# Altium project Zynq 7000 Demo.PrjPcb (part 8 of 9)

## Sheet [12] - CAN & RS232.SchDoc: CAN & RS232
size B; Organization: Altium Limited; Address1: L3, 12a Rodborough Rd; Address2: Frenchs Forest; Address3: NSW; Address4: Australia 2086; DocumentNumber: 12; Revision: V1I1; SheetNumber: 12; SheetTotal: 16
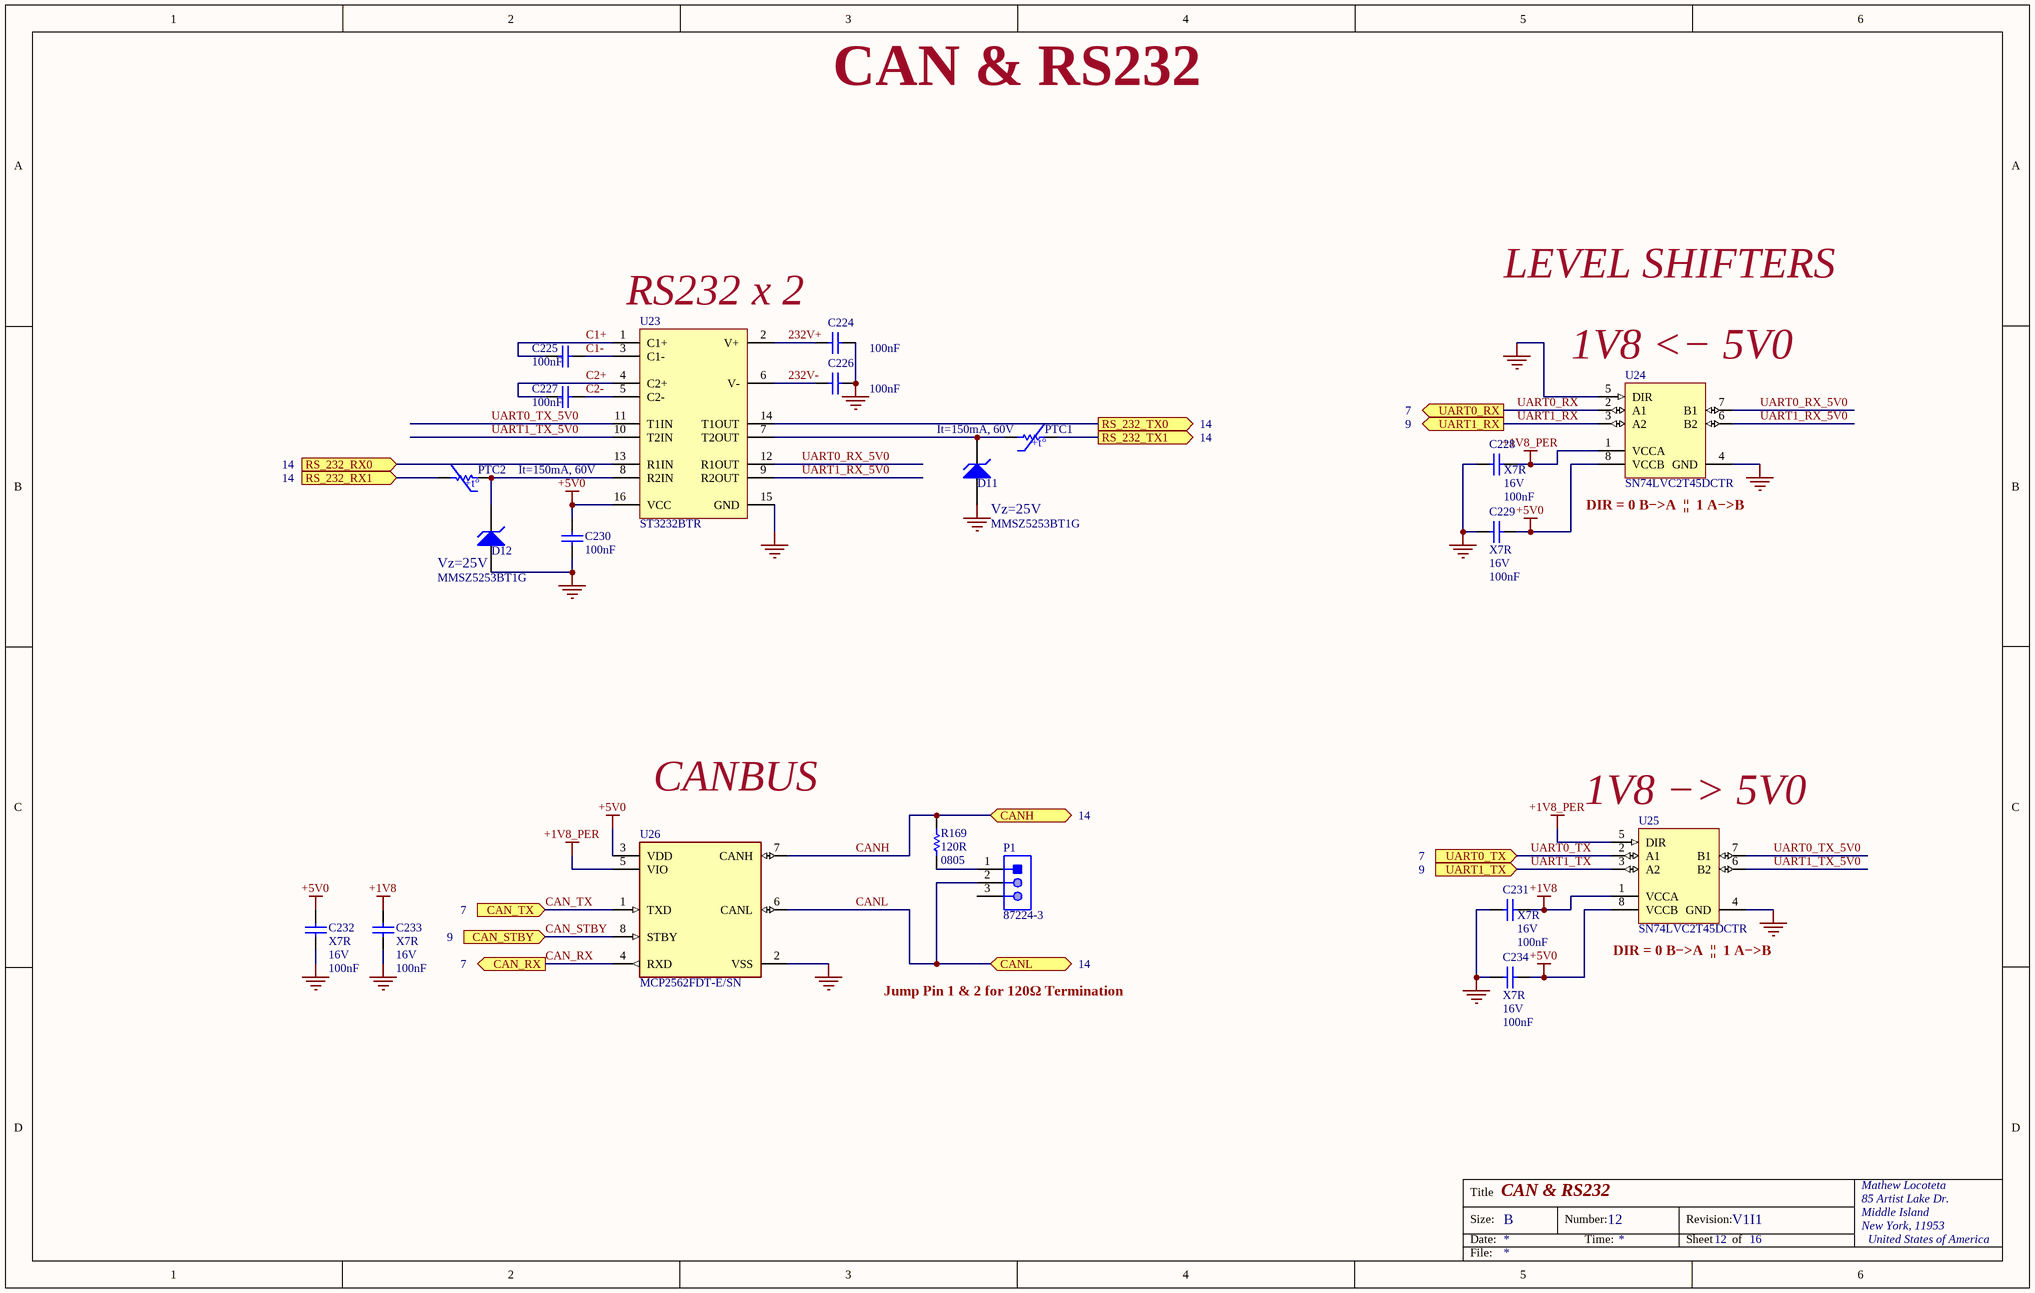
[diagram p11: [12] - CAN & RS232.SchDoc]

### Parts
C224  Capacitance: 100nF  (hidden comment: 100nF 0402 16V)
C225  Capacitance: 100nF  (hidden comment: 100nF 0402 16V)
C226  Capacitance: 100nF  (hidden comment: 100nF 0402 16V)
C227  Capacitance: 100nF  (hidden comment: 100nF 0402 16V)
C228  Dielectric: X7R  Voltage Rating: 16V  Capacitance: 100nF  (hidden comment: 100nF 0402 16V)
C229  Dielectric: X7R  Voltage Rating: 16V  Capacitance: 100nF  (hidden comment: 100nF 0402 16V)
C230  Capacitance: 100nF  (hidden comment: 100nF 0402 16V)
C231  Dielectric: X7R  Voltage Rating: 16V  Capacitance: 100nF  (hidden comment: 100nF 0402 16V)
C232  Dielectric: X7R  Voltage Rating: 16V  Capacitance: 100nF  (hidden comment: 100nF 0402 16V)
C233  Dielectric: X7R  Voltage Rating: 16V  Capacitance: 100nF  (hidden comment: 100nF 0402 16V)
C234  Dielectric: X7R  Voltage Rating: 16V  Capacitance: 100nF  (hidden comment: 100nF 0402 16V)
D11  MMSZ5253BT1G  [ONSC-SOD-123-2-425-04_V]
D12  MMSZ5253BT1G  [ONSC-SOD-123-2-425-04_V]
P1  87224-3  [TECO-87224-3_V]
PTC1  It=150mA, 60V  [R1206]
PTC2  It=150mA, 60V  [R1206]
R169  value 120R  Case: 0805  [RESC2013X50X30LL20T20]  (hidden comment: CRCW0805120RJNEA)
U23  ST3232BTR  [STM-TSSOP-16_L]
U24  SN74LVC2T45DCTR  [DCT0008A_N]
U25  SN74LVC2T45DCTR  [DCT0008A_N]
U26  MCP2562FDT-E/SN  [FP-C04-057-SN-MFG]

### Ports
CAN_RX (out), CAN_STBY (in), CAN_TX (in), CANH (bidir), CANL (bidir), RS_232_RX0 (in), RS_232_RX1 (in), RS_232_TX0 (out), RS_232_TX1 (out), UART0_RX (out), UART0_TX (in), UART1_RX (out), UART1_TX (in)

### Nets
+1V8: C231.1 C233.2 U25.1(VCCA)
+1V8_PER: C228.1 U24.1(VCCA) U25.5(DIR) U26.5(VIO)
+5V0: C229.2 C230.2 C232.2 C234.2 U23.16(VCC) U24.8(VCCB) U25.8(VCCB) U26.3(VDD)
GND: C224.1 C226.1 C228.2 C229.1 C230.1 C231.2 C232.1 C233.1 C234.1 D11.2(A) D12.2(A) U23.15(GND) U24.4(GND) U24.5(DIR) U25.4(GND) U26.2(VSS)
232V+: C224.2 U23.2(V+)
232V-: C226.2 U23.6(V-)
C1+: C225.1 U23.1(C1+)
C1-: C225.2 U23.3(C1-)
C2+: C227.1 U23.4(C2+)
C2-: C227.2 U23.5(C2-)
CAN_RX: U26.4(RXD) ; port CAN_RX
CAN_STBY: U26.8(STBY) ; port CAN_STBY
CAN_TX: U26.1(TXD) ; port CAN_TX
CANH: R169.1 U26.7(CANH) ; port CANH
CANL: P1.2 U26.6(CANL) ; port CANL
RS_232_RX0: U23.13(R1IN) ; port RS_232_RX0
RS_232_RX1: PTC2.2 ; port RS_232_RX1
RS_232_TX0: U23.14(T1OUT) ; port RS_232_TX0
RS_232_TX1: PTC1.2 ; port RS_232_TX1
UART0_RX: U24.2(A1) ; port UART0_RX
UART0_RX_5V0: U23.12(R1OUT) U24.7(B1)
UART0_TX: U25.2(A1) ; port UART0_TX
UART0_TX_5V0: U23.11(T1IN) U25.7(B1)
UART1_RX: U24.3(A2) ; port UART1_RX
UART1_RX_5V0: U23.9(R2OUT) U24.6(B2)
UART1_TX: U25.3(A2) ; port UART1_TX
UART1_TX_5V0: U23.10(T2IN) U25.6(B2)
NetD11_1: D11.1(K) PTC1.1 U23.7(T2OUT)
NetD12_1: D12.1(K) PTC2.1 U23.8(R2IN)
NetP1_1: P1.1 R169.2

Not connected (* = marked no-connect by the designer): P1 3

### Notes on the sheet
- CAN & RS232
- LEVEL SHIFTERS
- RS232 x 2
- (near U24) 1V8 <− 5V0
- 14
- 7
- 9
- (near U24) DIR = 0 B−>A  ||  1 A−>B
- (near D12) Vz=25V
- (near D11) Vz=25V
- CANBUS
- (near U25) 1V8 −> 5V0
- (near U25) DIR = 0 B−>A  ||  1 A−>B
- Jump Pin 1 & 2 for 120Ω Termination
- Title
- Size:
- Date:
- B
- Number:
- Time:
- Revision:
- Sheet
- of
- Mathew Locoteta
- 85 Artist Lake Dr.
- Middle Island
- New York, 11953
- United States of America
- File:
- (in symbol 0ZCJ0005FF2E) +t°

### Library data of the parts
C224-C234 = C0402C104J4RACTU: as C159-C171 on sheet [9] - Z7010 B35, ADC, DAC; Supplier 1: Digi-Key; Manufacturer: KEMET; Manufacturer Part Number: C0402C104J4RACTU; RoHS: Yes; Category: Ceramic Capacitors; Stock 1: 106350; Pricing 1: 1=0.48000, 10=0.33900, 50=0.25620, 100=0.22310, 500=0.16528, 1000=0.14049, 2500=0.13223, 5000=0.12396 (USD); Mount: Surface Mount,PCB; Case/Package: 0402; Case Code (Metric): 1005; Case Code (Imperial): 0402; Dielectric Material: Ceramic; Contact Plating: Tin,Matte; Min Operating Temperature: -55°C; Max Operating Temperature: 125°C; Tolerance: 5%; Packaging: Tape and Reel; Package Quantity: 1; Termination: SMD/SMT; Voltage: 16V; Length: 1mm; Height: 0.5mm; Width: 0.02inch; Thickness: 0.022inch; Depth: 0.5mm; Radiation Hardening: No; REACH SVHC: No SVHC; ComponentLink1URL: https://datasheet.ciiva.com/5415/kem-c1002-x7r-smd-5415819.pdf?src-supplier=Mouser; ComponentLink1Description: https://datasheet.ciiva.com/5415/kem-c1002-x7r-smd-5415819.pdf?src-supplier=Mouser; ComponentLink2URL: https://datasheet.ciiva.com/46424/1851736-46424159.pdf?src-supplier=Element14; ComponentLink2Description: https://datasheet.ciiva.com/46424/1851736-46424159.pdf?src-supplier=Element14; Supplier Part Number 1: 399-7761-1-ND; Voltage Rating (DC): 16V
  C224-C227 C230: Dielectric: X7R; Voltage Rating: 16V
D11 D12 = CMP-1060-00460-1: Zener Voltage Regulator, 500 mW, 2-Pin SOD-123, Pb-Free, Tape and Reel; Manufacturer: On Semiconductor; P Max (W): 0.5; VZ Typ (V): 25; PackageVersion: Rev. G, 10/2009; RoHS: Pb-Free; PartNumber: MMSZ5253BT1G; DatasheetVersion: Rev. 12; PackageReference: SOD-123-2-425-04; ComponentLink2Description: Datasheet; Mounting Technology: Surface Mount; ComponentLink2URL: http://www.onsemi.com/pub_link/Collateral/MMSZ5221BT1-D.PDF; ComponentLink1Description: Manufacturer URL; ComponentLink3Description: Package Specification; ComponentLink3URL: http://www.onsemi.com/pub_link/Collateral/425-04.PDF; Packing: Tape and Reel; ComponentLink1URL: http://www.onsemi.com/; PackageDescription: 2-Pin SOD, Body 1.6 x 2.69 mm
P1 = CMP-2000-05697-1: Male Header, Pitch 2.54 mm, 1 x 3 Position, Height 10.744 mm, Tail Length 3.175 mm, -65 to 105 degC, RoHS, Bulk; Manufacturer: TE Connectivity; Catalog Drawings: SingleSquareStraightPost / SingleSquareStraightPostSide; Connector Type: Header,Unshrouded; Pitch: 0.100"(2.54mm); Mating Products: 147738-2-ND / -CONNRCPT3POSVERTSMDGOLD / 147723-2-ND / -CONNRCPT3POSVERT.100GOLD / 146763-5-ND / -CONNRCPT3POSSGLVERT.100T/H / A32904-ND / -CONNRECEPT3POS.100VERTGOLD / A26922-ND / -CONNHOUSING3POS.100LOCKING / A26415-ND / -CONNRECEPT3POS.100VERTAU / A26964-ND / -CONNHOUSING3POS.100SINGLE / A3012-ND / -CONNHOUSING3POS.100SINGLE; Number of Positions Loaded: All; Featured Product: AMPMODUConnectors; Dynamic Catalog: AMPMODUModIISeries; 3D Model: 87224-3.pdf; Other Names: 87224-3-ND / A26545; Number of Positions: 3; RoHS Information: 87224-3StatementofCompliance; Termination: Solder; Datasheet URL: http://www.te.com/commerce/DocumentDelivery/DDEController?Action=showdoc&DocId=Customer+Drawing%7F87224%7FL3%7Fpdf%7FEnglish%7FENG_CD_87224_L3.pdf%7F87224-3; Category: Connectors,Interconnects; Contact Mating Length: 0.318"(8.08mm); Standard Package: 520; Mounting Type: ThroughHole; Family: RectangularConnectors-Headers,MalePins; Number of Rows: 1; Series: AMPMODUModII; Contact Finish Thickness: 15µin(0.38µm); Datasheet Version: Rev. L3, 08/2015; Package Reference: 87224-3; Mounting Technology: ThroughHole; Manufacturer URL: http://www.te.com/; Contact Type: MalePin; Packaging: Bulk; Color: Black; Package Description: Male Header, Pitch 2.54 mm, 1 x 3 Position, Height 10.744 mm, Tail Length 3.175 mm; Contact Finish: Gold
PTC1 PTC2 = 0ZCJ0005FF2E: PTC RESET FUSE 60V 50MA 1206; Manufacturer: Bel; Max Current Rating: 10A; Power Dissipation: 400mW; Trip Current: 150mA; Time to Trip: 1.5s; Approvals: UL,TUV; Supplier 1: Digi-Key; Manufacturer Part Number: 0ZCJ0005FF2E; RoHS: Yes; Category: Fuses; Stock 1: 295306; Pricing 1: 1=0.13000, 5=0.13000, 10=0.12500, 50=0.11140, 100=0.10370, 250=0.09216, 500=0.07680, 1000=0.07296 (USD); Mount: Surface Mount; Case/Package: 1206; Case Code (Metric): 3216; Case Code (Imperial): 1206; Contact Plating: Tin,Matte; Number of Terminals: 2; Min Operating Temperature: -40°C; Max Operating Temperature: 85°C; Package Quantity: 1; Packaging: Tape and Reel; Max Voltage Rating (DC): 60V; Hold Current: 50mA; Lead Free: Lead Free; ComponentLink1URL: https://datasheet.ciiva.com/18550/0zcj-18550517.pdf?src-supplier=Digi-Key; ComponentLink1Description: https://datasheet.ciiva.com/18550/0zcj-18550517.pdf?src-supplier=Digi-Key; ComponentLink2URL: https://datasheet.ciiva.com/18550/0zcj-18550518.pdf?src-supplier=Digi-Key; ComponentLink2Description: https://datasheet.ciiva.com/18550/0zcj-18550518.pdf?src-supplier=Digi-Key; ComponentLink3URL: https://datasheet.ciiva.com/18550/0zcj-18550519.pdf?src-supplier=Digi-Key; ComponentLink3Description: https://datasheet.ciiva.com/18550/0zcj-18550519.pdf?src-supplier=Digi-Key; Supplier Part Number 1: 507-1793-1-ND
R169 = CMP-2001-04288-1: Manufacturer: Vishay Dale; Part Number: CRCW0805120RJNEA
U23 = CMP-2000-07155-1: RS-232 Driver and Receiver, 3 to 5.5 V, -40 to 85 degC, 16-Pin TSSOP, RoHS, Tape and Reel; Manufacturer: STMicroelectronics; Dual Supply Voltage (Min): NotRequiredV; Power Supply Requirement: Single; Receiver Signal Type: Single-Ended; Number of Transmitters: 2; Single Supply Voltage (Typ): 3.3/5V; Supply Current: 2mA; Single Supply Voltage (Min): 3V; DELETED: Compliant; Data Rate: 0.4kbps; Number of Transceivers: 1; Rad Hardened: No; Single Supply Voltage (Max): 5.5V; Data Transmission Topology: Point-to-Point; Datasheet URL: http://www.st.com/content/ccc/resource/technical/document/datasheet/group1/40/2c/7f/62/3a/3f/47/3c/CD00002253/files/CD00002253.pdf/jcr:content/translations/en.CD00002253.pdf; Dual Supply Voltage (Max): NotRequiredV; Packaging: TapeandReel; Mounting Technology: SurfaceMount; Package Reference: TSSOP-16; Operating Temperature Classification: Industrial; Package Description: 16-Pin Thin Shrink Small Outline Package, Body 5 x 4.4 mm, Pitch 0.65 mm; Operating Temp Range: -40Cto85C; Manufacturer URL: http://www.st.com/; Datasheet Version: Rev. 12, 01/2016; Mounting: SurfaceMount; Dual Supply Voltage (Typ): NotRequiredV; Pin Count: 16; Number of Receivers: 2; Package Type: TSSOP; Interface Circuit Standard 1: RS-232; Transmitter Signal Type: Single-Ended
U24 U25 = CMP-0859-00006-4: Dual-Bit Dual Supply Transceiver with Configurable Voltage Translation and 3-State Outputs, DCT0008A, LARGE T&R; Manufacturer: Texas Instruments; Rating: Military; Input Type: CMOS/TTL; Schmitt Trigger: No; ICC @ Nom Voltage(Max)(mA): 0.004; Bits(#): 2; Logic: True; tpd @ Nom Voltage(Max)(ns): 17.7,10.3,8.3,7.2; VCC(Min)(V): 1.65; Voltage(Nom)(V): 1.8,2.5,3.3,5; Output Type: CMOS; F @ Nom Voltage(Max)(Mhz): 150; Technology Family: LVC; VCC(Max)(V): 5.5; Output Drive (IOL/IOH)(Max)(mA): 32/-32; 3-State Output: Yes; Sub-Family: Dual Supply Translator; Operating Temperature Range(C): -40 to 85; DatasheetVersion: SCES516J; Generic Part Number: SN74LVC2T45; PackageReference: DCT0008A
U26 = CMP-06279-000005-1: IC TRANSCEIVER 1/1 8SOIC; Operating Supply Current: 70mA; Data Rate: 8Mbps; Number of Transceivers: 1; Receiver Hysteresis: 200mV; Max Supply Voltage: 5.5V; Min Supply Voltage: 4.5V; Weight: 0.019048oz; Package Quantity: 3300; Case/Package: SOIC; Mount: Surface Mount; Max Operating Temperature: 125°C; Min Operating Temperature: -40°C; Packaging: Tape and Reel; Number of Pins: 8

## Sheet [13] - HMI.SchDoc: HMI
size B; Organization: Altium Limited; Address1: L3, 12a Rodborough Rd; Address2: Frenchs Forest; Address3: NSW; Address4: Australia 2086; DocumentNumber: 13; Revision: V1I1; SheetNumber: 13; SheetTotal: 16
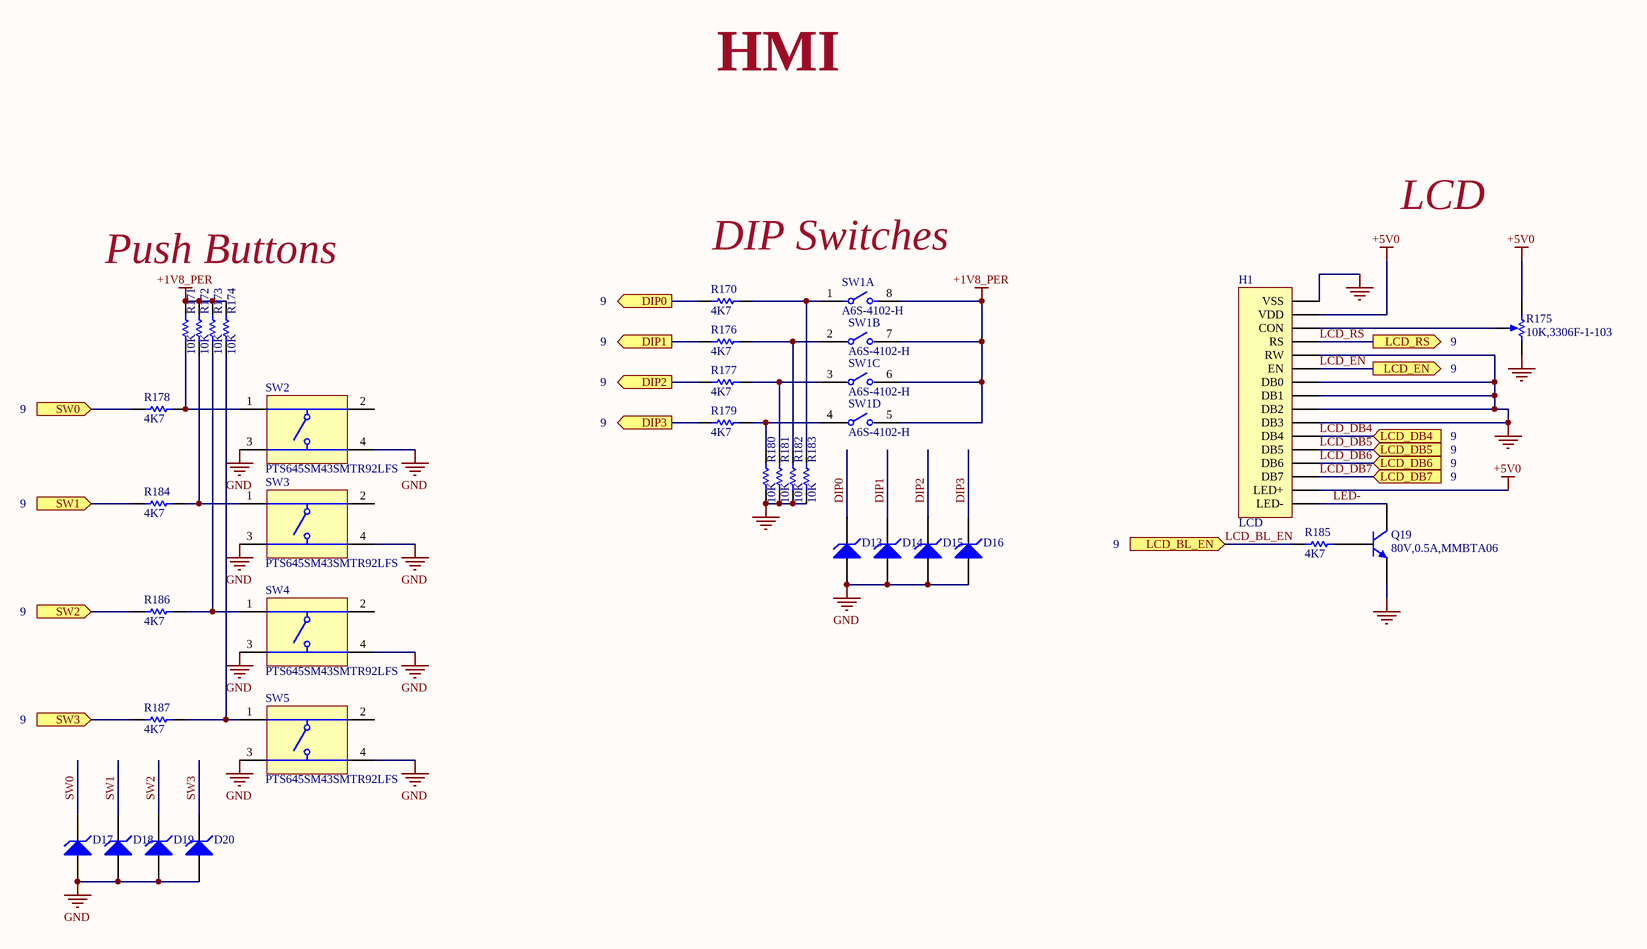
[diagram p12: [13] - HMI.SchDoc]

### Parts
D13  ESD5Z2.5T1G  [ONSC-SOD-523-2-502-01_V]  (value not drawn)
D14  ESD5Z2.5T1G  [ONSC-SOD-523-2-502-01_V]  (value not drawn)
D15  ESD5Z2.5T1G  [ONSC-SOD-523-2-502-01_V]  (value not drawn)
D16  ESD5Z2.5T1G  [ONSC-SOD-523-2-502-01_V]  (value not drawn)
D17  ESD5Z2.5T1G  [ONSC-SOD-523-2-502-01_V]  (value not drawn)
D18  ESD5Z2.5T1G  [ONSC-SOD-523-2-502-01_V]  (value not drawn)
D19  ESD5Z2.5T1G  [ONSC-SOD-523-2-502-01_V]  (value not drawn)
D20  ESD5Z2.5T1G  [ONSC-SOD-523-2-502-01_V]  (value not drawn)
H1  LCD  [16POS 2.54MM, PREC016SFAN-RC]
Q19  80V,0.5A,MMBTA06  [ONSC-SOT-23-3-318-08_V]
R170  Resistance: 4K7  (hidden comment: 4K7 0402 1%)
R171  value 10K  [RESC1005X40X25ML05T10]  (hidden comment: CRCW040210K0FKEDHP)
R172  value 10K  [RESC1005X40X25ML05T10]  (hidden comment: CRCW040210K0FKEDHP)
R173  value 10K  [RESC1005X40X25ML05T10]  (hidden comment: CRCW040210K0FKEDHP)
R174  value 10K  [RESC1005X40X25ML05T10]  (hidden comment: CRCW040210K0FKEDHP)
R175  10K,3306F-1-103  [Pot, 3306F-1-103]
R176  Resistance: 4K7  (hidden comment: 4K7 0402 1%)
R177  Resistance: 4K7  (hidden comment: 4K7 0402 1%)
R178  Resistance: 4K7  (hidden comment: 4K7 0402 1%)
R179  Resistance: 4K7  (hidden comment: 4K7 0402 1%)
R180  value 10K  [RESC1005X40X25ML05T10]  (hidden comment: CRCW040210K0FKEDHP)
R181  value 10K  [RESC1005X40X25ML05T10]  (hidden comment: CRCW040210K0FKEDHP)
R182  value 10K  [RESC1005X40X25ML05T10]  (hidden comment: CRCW040210K0FKEDHP)
R183  value 10K  [RESC1005X40X25ML05T10]  (hidden comment: CRCW040210K0FKEDHP)
R184  Resistance: 4K7  (hidden comment: 4K7 0402 1%)
R185  4K7  [R0805]
R186  Resistance: 4K7  (hidden comment: 4K7 0402 1%)
R187  Resistance: 4K7  (hidden comment: 4K7 0402 1%)
SW1  A6S-4102-H  [FP-A6S-4102-H-MFG]  (parts A,B,C,D of 4)
SW2  PTS645SM43SMTR92LFS  [ITT-PTS645S-4_V]
SW3  PTS645SM43SMTR92LFS  [ITT-PTS645S-4_V]
SW4  PTS645SM43SMTR92LFS  [ITT-PTS645S-4_V]
SW5  PTS645SM43SMTR92LFS  [ITT-PTS645S-4_V]

### Ports
DIP0 (out), DIP1 (out), DIP2 (out), DIP3 (out), LCD_BL_EN (in), LCD_DB4 (in), LCD_DB5 (in), LCD_DB6 (in), LCD_DB7 (in), LCD_EN (out), LCD_RS (out), SW0 (in), SW1 (in), SW2 (in), SW3 (in)

### Nets
+1V8_PER: R171.2 R172.2 R173.2 R174.2 SW1.5 SW1.6 SW1.7 SW1.8
+5V0: H1.2(VDD) H1.15(LED+) R175.1(CCW)
GND: D13.2(A) D14.2(A) D15.2(A) D16.2(A) D17.2(A) D18.2(A) D19.2(A) D20.2(A) H1.1(VSS) H1.5(RW) H1.7(DB0) H1.8(DB1) H1.9(DB2) H1.10(DB3) Q19.2(E) R175.3(CW) R180.1 R181.1 R182.1 R183.1 SW2.3 SW2.4 SW3.3 SW3.4 SW4.3 SW4.4 SW5.3 SW5.4
DIP0: R170.2 ; port DIP0
DIP0: D13.1(K)  [a separate net that carries the same name]
DIP1: R176.2 ; port DIP1
DIP1: D14.1(K)  [a separate net that carries the same name]
DIP2: R177.2 ; port DIP2
DIP2: D15.1(K)  [a separate net that carries the same name]
DIP3: R179.2 ; port DIP3
DIP3: D16.1(K)  [a separate net that carries the same name]
LCD_BL_EN: R185.1 ; port LCD_BL_EN
LCD_DB4: H1.11(DB4) ; port LCD_DB4
LCD_DB5: H1.12(DB5) ; port LCD_DB5
LCD_DB6: H1.13(DB6) ; port LCD_DB6
LCD_DB7: H1.14(DB7) ; port LCD_DB7
LCD_EN: H1.6(EN) ; port LCD_EN
LCD_RS: H1.4(RS) ; port LCD_RS
LED-: H1.16(LED-) Q19.3(C)
SW0: R178.2 ; port SW0
SW0: D17.1(K)  [a separate net that carries the same name]
SW1: R184.2 ; port SW1
SW1: D18.1(K)  [a separate net that carries the same name]
SW2: R186.2 ; port SW2
SW2: D19.1(K)  [a separate net that carries the same name]
SW3: R187.2 ; port SW3
SW3: D20.1(K)  [a separate net that carries the same name]
NetH1_3: H1.3(CON) R175.2(TAP)
NetQ19_1: Q19.1(B) R185.2
NetR170_1: R170.1 R183.2 SW1.1
NetR171_1: R171.1 R178.1 SW2.1
NetR172_1: R172.1 R184.1 SW3.1
NetR173_1: R173.1 R186.1 SW4.1
NetR174_1: R174.1 R187.1 SW5.1
NetR176_1: R176.1 R182.2 SW1.2
NetR177_1: R177.1 R181.2 SW1.3
NetR179_1: R179.1 R180.2 SW1.4

Not connected (* = marked no-connect by the designer): SW2 2; SW3 2; SW4 2; SW5 2

### Notes on the sheet
- HMI
- Push Buttons
- DIP Switches
- LCD
- 9
- (near R175) 9
- Title
- Size:
- Date:
- B
- Number:
- Time:
- Revision:
- Sheet
- of
- Mathew Locoteta
- 85 Artist Lake Dr.
- Middle Island
- New York, 11953
- United States of America
- File:

### Library data of the parts
D13-D20 = CMP-1063-00103-1: Transient Voltage Suppressor, Micro-Packaged Diode for ESD Protection, 2-Pin SOD-523, Pb-Free, Tape and Reel; Manufacturer: On Semiconductor; Direction: Unidirectional; PPK Max (W): 120; V(BR) Min (V): 4; VRWM Max (V): 2.5; Number of Lines: 1; IR Max (uA): 6; ComponentLink3Description: Package Specification; Packing: Tape and Reel; ComponentLink2URL: http://www.onsemi.cn/pub_link/Collateral/ESD5Z2.5T1-D.PDF; ComponentLink3URL: http://www.onsemi.com/pub_link/Collateral/502-01.PDF; PackageReference: SOD-523-2-502-01; PartNumber: ESD5Z2.5T1G; Mounting Technology: Surface Mount; DatasheetVersion: Rev. 10; PackageVersion: Rev. E, 09/2010; RoHS: Pb-Free; ComponentLink1Description: Manufacturer URL; PackageDescription: 2-Pin SOD, Body 1.2 x 0.8 mm; ComponentLink2Description: Datasheet; ComponentLink1URL: http://www.onsemi.com/
H1 = 4X20_LCD_HEADER: LCD Header; Manufacturer: Sullins; Manufacturer Part Number: PREC016SFAN-RC; Number of Positions: 16; Connector Type: Male Pin; Pitch: 0.1inch; Supplier 1: Digi-Key; Stock 1: 2071; Pricing 1: 1=0.40000, 10=0.37600, 25=0.32240, 50=0.27420, 100=0.26340, 250=0.23656, 500=0.22580 (USD); RoHS: Yes; Mount: Through Hole; Color: Black; Contact Plating: Tin; Package Quantity: 1; Number of Rows: 1; Packaging: Bulk; Termination: Solder; Contact Mating Length: 0.318inch; ComponentLink1URL: https://datasheet.ciiva.com/740/xrxczzzsxxn-rc-st-11635-b-740949.pdf?src-supplier=Digi-Key; ComponentLink1Description: https://datasheet.ciiva.com/740/xrxczzzsxxn-rc-st-11635-b-740949.pdf?src-supplier=Digi-Key; Supplier Part Number 1: S1212EC-16-ND
Q19 = MMBTA06LT1G: TRANS NPN 80V 0.5A SOT23; Manufacturer: ON Semiconductor; Max Power Dissipation: 225mW; Number of Elements: 1; Frequency: 100MHz; Emitter Base Voltage (VEBO): 4V; Collector Emitter Saturation Voltage: 250mV; Max Collector Current: 500mA; Power Dissipation: 300mW; Element Configuration: Single; hFE Min: 100; Supplier 1: Digi-Key; Manufacturer Part Number: MMBTA06LT1G; Stock 1: 502614; Pricing 1: 1=0.19000, 10=0.17000, 100=0.09230, 500=0.05682, 1000=0.03874 (USD); RoHS: Yes; Case/Package: SOT-23-3; Number of Pins: 3; Contact Plating: Tin,Matte; Min Operating Temperature: -55°C; Max Operating Temperature: 150°C; Package Quantity: 1; Collector Emitter Voltage (VCEO): 80V; Packaging: Tape and Reel; Polarity: NPN; Collector Base Voltage (VCBO): 80V; Collector Emitter Breakdown Voltage: 80V; Transition Frequency: 100MHz; Max Breakdown Voltage: 80V; Max Frequency: 100MHz; Gain Bandwidth Product: 100MHz; Voltage Rating (DC): 80V; Current Rating: 500mA; Length: 0.119inch; Height: 0.04inch; Width: 0.055inch; Radiation Hardening: No; REACH SVHC: No SVHC; Lead Free: Lead Free; ComponentLink1URL: https://datasheet.ciiva.com/4722/mmbta05lt1-d-101659-4722113.pdf?src-supplier=Mouser; ComponentLink1Description: https://datasheet.ciiva.com/4722/mmbta05lt1-d-101659-4722113.pdf?src-supplier=Mouser; ComponentLink2URL: https://datasheet.ciiva.com/15139/getdatasheetpartid-137838-15139444.pdf?src-supplier=Verical; ComponentLink2Description: https://datasheet.ciiva.com/15139/getdatasheetpartid-137838-15139444.pdf?src-supplier=Verical; ComponentLink3URL: https://datasheet.ciiva.com/11197/mmbta05lt1-d-11197414.pdf?src-supplier=Avnet; ComponentLink3Description: https://datasheet.ciiva.com/11197/mmbta05lt1-d-11197414.pdf?src-supplier=Avnet; ComponentLink4URL: https://datasheet.ciiva.com/976/mmbta05lt1-d-976473.pdf?src-supplier=Digi-Key; ComponentLink4Description: https://datasheet.ciiva.com/976/mmbta05lt1-d-976473.pdf?src-supplier=Digi-Key; ComponentLink5URL: https://datasheet.ciiva.com/976/mmbta05lt1-d-976474.pdf?src-supplier=Digi-Key; ComponentLink5Description: https://datasheet.ciiva.com/976/mmbta05lt1-d-976474.pdf?src-supplier=Digi-Key; ComponentLink6URL: https://datasheet.ciiva.com/25998/mmbta05lt1-d-25998830.pdf?src-supplier=Avnet+Europe; ComponentLink6Description: https://datasheet.ciiva.com/25998/mmbta05lt1-d-25998830.pdf?src-supplier=Avnet+Europe; ComponentLink7URL: https://datasheet.ciiva.com/16465/mmbta05lt1-d-16465685.pdf?src-supplier=Future+Electronics; ComponentLink7Description: https://datasheet.ciiva.com/16465/mmbta05lt1-d-16465685.pdf?src-supplier=Future+Electronics; ComponentLink8URL: https://datasheet.ciiva.com/11198/mmbta05lt1-d-11198678.pdf?src-supplier=Avnet; ComponentLink8Description: https://datasheet.ciiva.com/11198/mmbta05lt1-d-11198678.pdf?src-supplier=Avnet; ComponentLink9URL: https://datasheet.ciiva.com/976/mmbta05lt1-d-976475.pdf?src-supplier=Digi-Key; ComponentLink9Description: https://datasheet.ciiva.com/976/mmbta05lt1-d-976475.pdf?src-supplier=Digi-Key; ComponentLink10URL: https://datasheet.ciiva.com/7972/mmbta05lt1-d-7972078.pdf?src-supplier=Element14; ComponentLink10Description: https://datasheet.ciiva.com/7972/mmbta05lt1-d-7972078.pdf?src-supplier=Element14; ComponentLink11URL: https://datasheet.ciiva.com/16478/mmbta05lt1-d-16478574.pdf?src-supplier=Avnet+Asia; ComponentLink11Description: https://datasheet.ciiva.com/16478/mmbta05lt1-d-16478574.pdf?src-supplier=Avnet+Asia; Supplier Part Number 1: MMBTA06LT1GOSCT-ND
R170 R176-R179 R184 R186 R187 = CRCW04024K70FKED: Resistor SMD 4.7 kOhm 0402 PU=10000 ST, CRCW04024K70FKED, Vishay; Power Rating: 63mW; Temperature Coefficient: 100ppm/°C; Voltage Rating: 50V; Supplier 1: Digi-Key; Manufacturer: Vishay; Manufacturer Part Number: CRCW04024K70FKED; RoHS: Yes; Category: Chip SMD Resistors; Stock 1: 575743; Pricing 1: 1=0.10000, 10=0.03500, 100=0.01410, 1000=0.00633, 2500=0.00550, 5000=0.00454 (USD); Mount: Surface Mount; Case/Package: 0402; Weight: 2.3E-05oz; Contact Plating: Tin; Case Code (Imperial): 0402; Case Code (Metric): 1005; Min Operating Temperature: -55°C; Max Operating Temperature: 155°C; Tolerance: 1%; Composition: Thick Film; Packaging: Tape and Reel; Package Quantity: 10; Termination: SMD/SMT; Military Standard: Not; Voltage Rating (DC): 50V; Number of Terminations: 2; Max Power Dissipation: 63mW; Features: Automotive AEC-Q200; Length: 1mm; Height: 0.35mm; Width: 0.5mm; Depth: 0.5mm; Radiation Hardening: No; Lead Free: Lead Free; REACH SVHC: Unknown; ComponentLink1URL: https://datasheet.ciiva.com/11808/0900766b80d98824-11808622.pdf?src-supplier=RSComponents; ComponentLink1Description: https://datasheet.ciiva.com/11808/0900766b80d98824-11808622.pdf?src-supplier=RSComponents; ComponentLink2URL: https://datasheet.ciiva.com/3256/dcrcwe3-3256597.pdf?src-supplier=Avnet; ComponentLink2Description: https://datasheet.ciiva.com/3256/dcrcwe3-3256597.pdf?src-supplier=Avnet; ComponentLink3URL: https://datasheet.ciiva.com/5550/dcrcwe3-109170-5550295.pdf?src-supplier=Mouser; ComponentLink3Description: https://datasheet.ciiva.com/5550/dcrcwe3-109170-5550295.pdf?src-supplier=Mouser; ComponentLink4URL: https://datasheet.ciiva.com/16764/70201119-16764281.pdf?src-supplier=Allied+Electronics; ComponentLink4Description: https://datasheet.ciiva.com/16764/70201119-16764281.pdf?src-supplier=Allied+Electronics; ComponentLink5URL: https://datasheet.ciiva.com/2463/dcrcwe3-2463034.pdf?src-supplier=Digi-Key; ComponentLink5Description: https://datasheet.ciiva.com/2463/dcrcwe3-2463034.pdf?src-supplier=Digi-Key; ComponentLink6URL: https://datasheet.ciiva.com/16881/dcrcwe3-16881690.pdf?src-supplier=Avnet+Europe; ComponentLink6Description: https://datasheet.ciiva.com/16881/dcrcwe3-16881690.pdf?src-supplier=Avnet+Europe; ComponentLink7URL: https://datasheet.ciiva.com/2463/dcrcwe3-2463035.pdf?src-supplier=Digi-Key; ComponentLink7Description: https://datasheet.ciiva.com/2463/dcrcwe3-2463035.pdf?src-supplier=Digi-Key; ComponentLink8URL: https://datasheet.ciiva.com/8079/1697337-8079643.pdf?src-supplier=Element14; ComponentLink8Description: https://datasheet.ciiva.com/8079/1697337-8079643.pdf?src-supplier=Element14; ComponentLink9URL: https://datasheet.ciiva.com/2463/dcrcwe3-2463036.pdf?src-supplier=Digi-Key; ComponentLink9Description: https://datasheet.ciiva.com/2463/dcrcwe3-2463036.pdf?src-supplier=Digi-Key; ComponentLink10URL: https://datasheet.ciiva.com/26316/fld-crcw-e3-data-en-26316654.pdf?src-supplier=Distrelec; ComponentLink10Description: https://datasheet.ciiva.com/26316/fld-crcw-e3-data-en-26316654.pdf?src-supplier=Distrelec; Supplier Part Number 1: 541-4.70KLCT-ND
R171-R174 R180-R183 = CMP-2002-03043-1: Manufacturer: Vishay Dale; Part Number: CRCW040210K0FKEDHP
R175 = 3306F-1-103: BOURNS   3306F-1-103   TRIMMER, 10K, 6MM; Voltage Rating (DC): 100V; Power Rating: 200mW; Resistance: 10kR; Tolerance: 25%; Temperature Coefficient: 250ppm/°C; Number of Turns: 1; Supplier 1: Digi-Key; Manufacturer: Bourns; Manufacturer Part Number: 3306F-1-103; Stock 1: 8643; Pricing 1: 1=0.43000, 10=0.40000, 25=0.36000, 50=0.34800, 100=0.33600, 250=0.31200, 500=0.28800, 1000=0.27000, 5000=0.20400 (USD); RoHS: Yes; Mount: Through Hole,PCB; Weight: 360mg; Color: Blue; Min Operating Temperature: -25°C; Max Operating Temperature: 100°C; Packaging: Bulk; Termination: Pin; Package Quantity: 200; Composition: Cermet; Military Standard: Not; Max Power Dissipation: 200mW; Diameter: 6.81mm; Length: 6.81mm; Height: 7.62mm; Depth: 8.1mm; Width: 6.81mm; Radiation Hardening: No; Lead Free: Lead Free; REACH SVHC: No SVHC; ComponentLink1URL: https://datasheet.ciiva.com/19482/2022027-19482163.pdf?src-supplier=Jameco; ComponentLink1Description: https://datasheet.ciiva.com/19482/2022027-19482163.pdf?src-supplier=Jameco; ComponentLink2URL: https://datasheet.ciiva.com/11832/0900766b80dbb841-11832473.pdf?src-supplier=RSComponents; ComponentLink2Description: https://datasheet.ciiva.com/11832/0900766b80dbb841-11832473.pdf?src-supplier=RSComponents; ComponentLink3URL: https://datasheet.ciiva.com/2156/3306-2156049.pdf?src-supplier=Digi-Key; ComponentLink3Description: https://datasheet.ciiva.com/2156/3306-2156049.pdf?src-supplier=Digi-Key; ComponentLink4URL: https://datasheet.ciiva.com/16714/70154382-16714822.pdf?src-supplier=Allied+Electronics; ComponentLink4Description: https://datasheet.ciiva.com/16714/70154382-16714822.pdf?src-supplier=Allied+Electronics; ComponentLink5URL: https://datasheet.ciiva.com/23643/1815113-23643834.pdf?src-supplier=Newark; ComponentLink5Description: https://datasheet.ciiva.com/23643/1815113-23643834.pdf?src-supplier=Newark; ComponentLink6URL: https://datasheet.ciiva.com/26820/getdatasheetpartid-134310-26820122.pdf?src-supplier=Verical; ComponentLink6Description: https://datasheet.ciiva.com/26820/getdatasheetpartid-134310-26820122.pdf?src-supplier=Verical; ComponentLink7URL: https://datasheet.ciiva.com/8089/3306-8089643.pdf?src-supplier=Avnet; ComponentLink7Description: https://datasheet.ciiva.com/8089/3306-8089643.pdf?src-supplier=Avnet; ComponentLink8URL: https://datasheet.ciiva.com/1477/1815113-1477389.pdf?src-supplier=Element14; ComponentLink8Description: https://datasheet.ciiva.com/1477/1815113-1477389.pdf?src-supplier=Element14; Supplier Part Number 1: 3306F-103-ND
R185 = RMCF0805FT4K70: RES SMD 4.7K OHM 1% 1/8W 0805; Manufacturer: Stackpole Electronics; Resistance: 4.7kR; Power Rating: 125mW; Temperature Coefficient: 100ppm/°C; Supplier 1: Digi-Key; Manufacturer Part Number: RMCF0805FT4K70; Stock 1: 233318; Pricing 1: 1=0.10000, 10=0.02700, 100=0.01090, 1000=0.00490, 2500=0.00425 (USD); RoHS: Yes; Mount: Surface Mount; Case/Package: 0805; Case Code (Metric): 2012; Case Code (Imperial): 0805; Contact Plating: Tin,Matte; Min Operating Temperature: -55°C; Max Operating Temperature: 155°C; Tolerance: 1%; Packaging: Tape and Reel; Composition: Thick Film; Number of Terminations: 2; Military Standard: Not; Max Power Dissipation: 125mW; Features: Automotive AEC-Q200; Length: 2mm; Height: 0.026inch; Width: 0.049inch; Depth: 1.25mm; Radiation Hardening: No; Lead Free: Lead Free; ComponentLink1URL: http://www.seielect.com/catalog/sei-rmc.pdf?src-supplier=Future+Electronics; ComponentLink1Description: http://www.seielect.com/catalog/sei-rmc.pdf?src-supplier=Future+Electronics; ComponentLink2URL: http://components.arrow.com/part/dataview/44988207S7163511N1174?src-supplier=Arrow; ComponentLink2Description: http://components.arrow.com/part/dataview/44988207S7163511N1174?src-supplier=Arrow; ComponentLink3URL: https://www.seielect.com/catalog/SEI-RMCF_RMCP.pdf?src-supplier=Avnet; ComponentLink3Description: https://www.seielect.com/catalog/SEI-RMCF_RMCP.pdf?src-supplier=Avnet; ComponentLink4URL: https://www.seielect.com/Catalog/SEI-RMCF_RMCP.pdf?src-supplier=Digi-Key; ComponentLink4Description: https://www.seielect.com/Catalog/SEI-RMCF_RMCP.pdf?src-supplier=Digi-Key; ComponentLink5URL: https://www.seielect.com/catalog/SEI-Packaging.pdf?src-supplier=Digi-Key; ComponentLink5Description: https://www.seielect.com/catalog/SEI-Packaging.pdf?src-supplier=Digi-Key; ComponentLink6URL: https://www.verical.com/server-webapp/html/getDatasheet?partID=409513&src-supplier=Verical; ComponentLink6Description: https://www.verical.com/server-webapp/html/getDatasheet?partID=409513&src-supplier=Verical; Supplier Part Number 1: RMCF0805FT4K70CT-ND
SW1 = CMP-08827-000002-1: SWITCH SLIDE DIP SPST 25MA 24V; Manufacturer: Omron; Standoff Height: 0.7mm; Number Of Circuits: 4; Electromechanical Life: 1000Cycles; Contact Resistance: 200mΩ; Description: Switch DIP OFF ON SPST 4 Recessed Slide 0.025A 24VDC Gull Wing 1000Cycles 2.54mm SMD Tube; Package: 0; Temperature: -20°C to +70°C; Ambient Temperature Range High: +70°C; ComponentLink2Description: Datasheet; Temperature Range Low: -20°C; Lead Free: Yes; Manufacturer Part Number: A6S-4102-H; Automotive: No; Octopart: https://octopart.com/a6s-4102-h-omron-1228983; Voltage Rating Dc: 24V; Height: 3.8mm; Temperature Range High: +70°C; ComponentLink2URL: https://omronfs.omron.com/en_US/ecb/products/pdf/en-a6s.pdf; Device Class L2: Switches; Category: Switch; Ambient Temperature Range Low: -20°C; Throw Configuration: SPST; Digikey Description: SWITCH SLIDE DIP SPST 25MA 24V; Mouser Description: DIP Switches / SIP Switches Flat with Seal Tape 4 Poles; RoHS: TRUE; Mount: Surface Mount; Device Class L3: DIP Switches; Contact Current Rating: 25mA; Device Class L1: Electromechanical
SW2-SW5 = CMP-2000-05160-1: 6 mm Tact Switche, SPST, NO, -20 to 60 degC, 4-Pin SMT, RoHS, Tape and Reel; Manufacturer: ITT Cannon; Manufacturer URL: http://www.ittcannon.com/; Datasheet Version: Feb-14; Datasheet URL: https://datasheet.ciiva.com/29903/getdatasheetpartid-786341-29903846.pdf

## Sheet [14] - CONNECTORS.SchDoc: CONNECTORS
size B; Organization: Altium Limited; Address1: L3, 12a Rodborough Rd; Address2: Frenchs Forest; Address3: NSW; Address4: Australia 2086; DocumentNumber: 14; Revision: V1I1; SheetNumber: 14; SheetTotal: 16
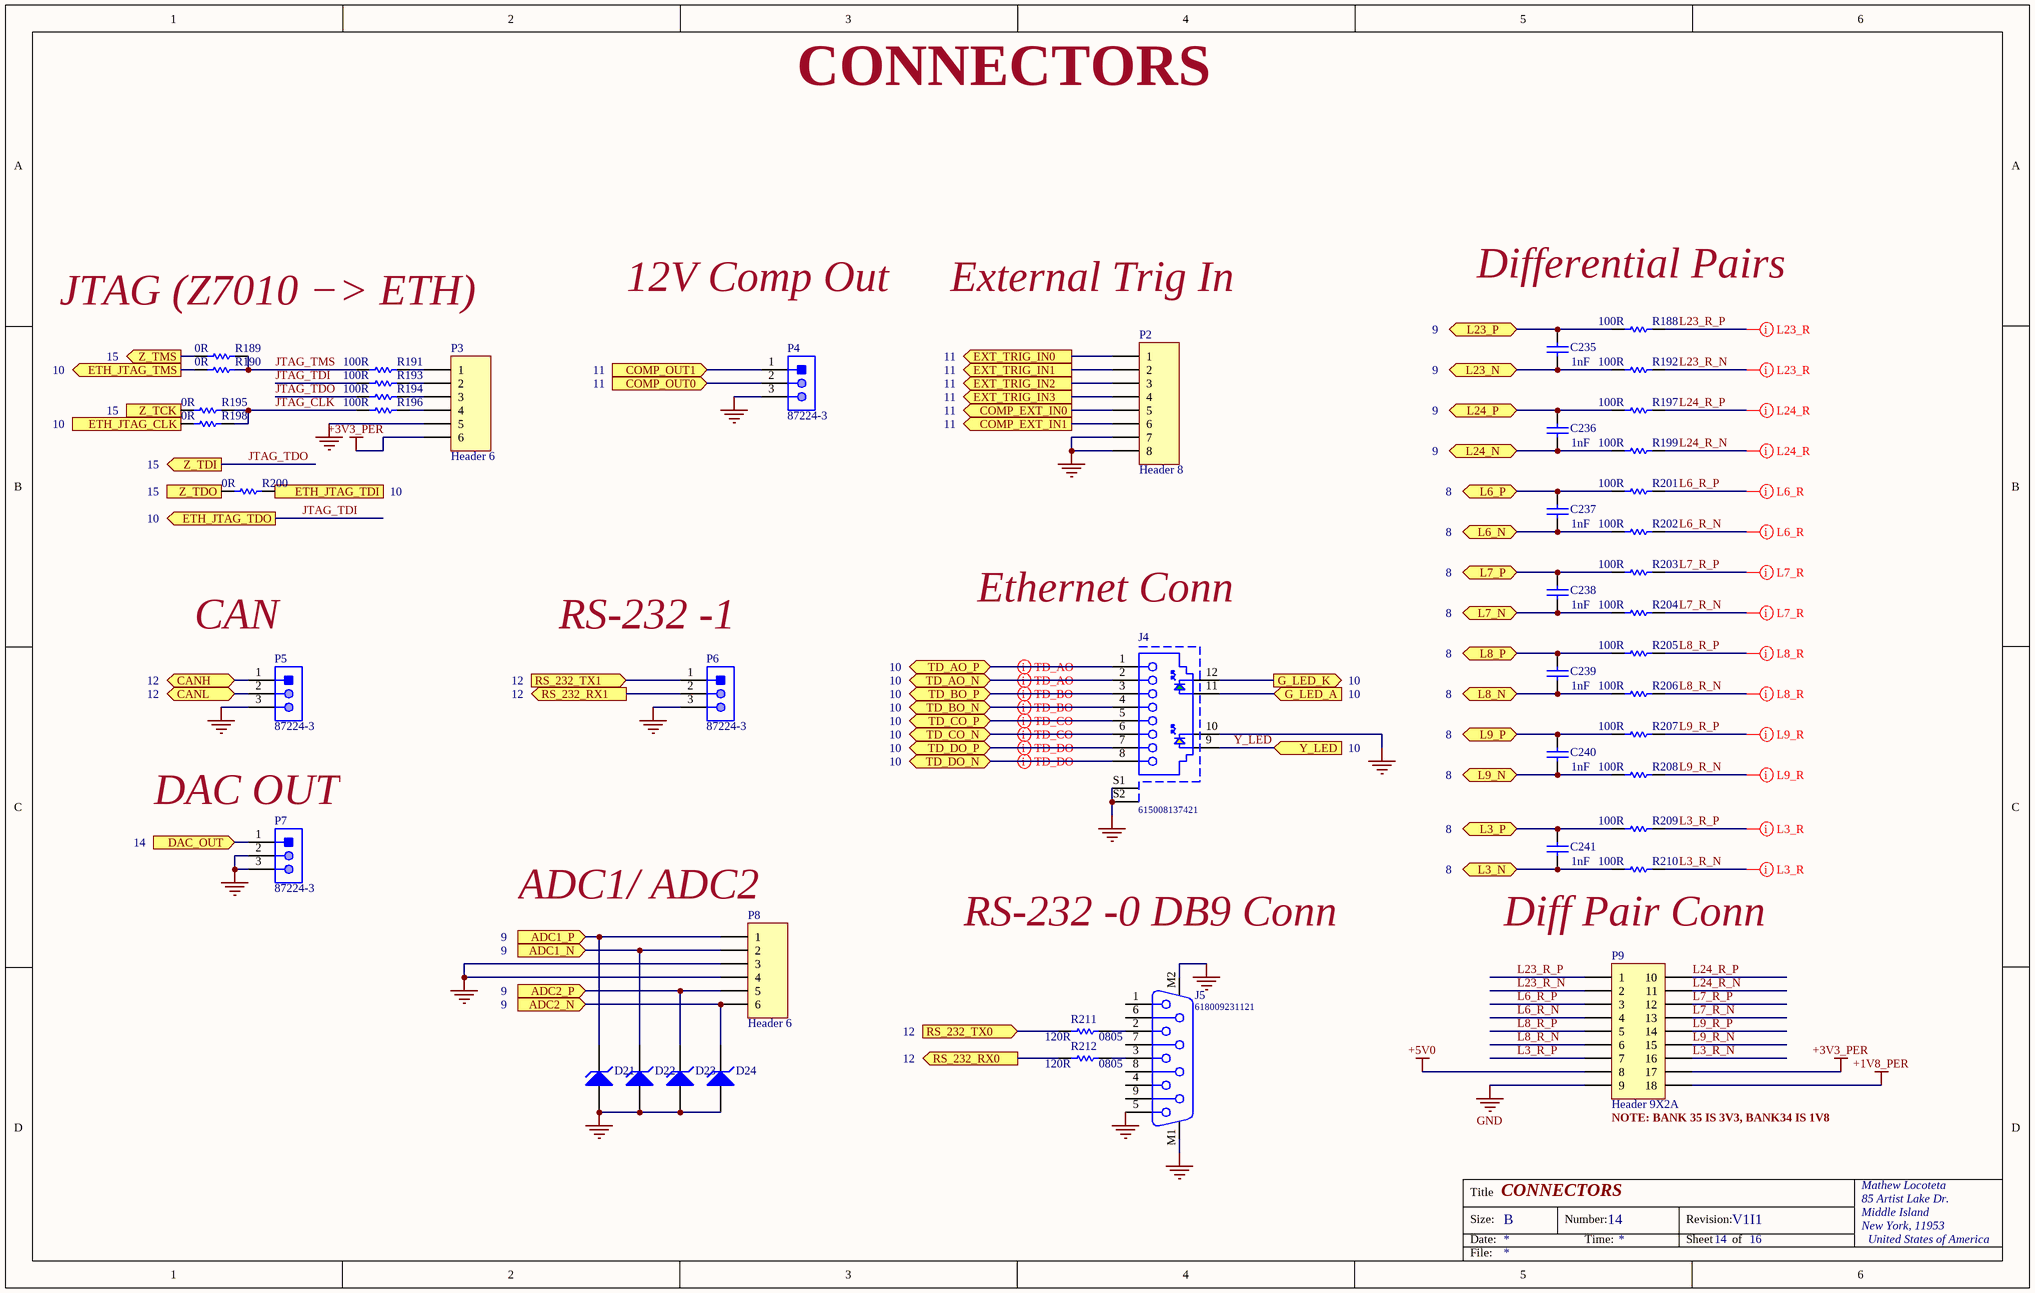
[diagram p13: [14] - CONNECTORS.SchDoc]

### Parts
C235  value 1nF  [CAPC1005X55X25LL05T10]  (hidden comment: GRM1555C1H102JA01D)
C236  value 1nF  [CAPC1005X55X25LL05T10]  (hidden comment: GRM1555C1H102JA01D)
C237  value 1nF  [CAPC1005X55X25LL05T10]  (hidden comment: GRM1555C1H102JA01D)
C238  value 1nF  [CAPC1005X55X25LL05T10]  (hidden comment: GRM1555C1H102JA01D)
C239  value 1nF  [CAPC1005X55X25LL05T10]  (hidden comment: GRM1555C1H102JA01D)
C240  value 1nF  [CAPC1005X55X25LL05T10]  (hidden comment: GRM1555C1H102JA01D)
C241  value 1nF  [CAPC1005X55X25LL05T10]  (hidden comment: GRM1555C1H102JA01D)
D21  ESD5Z2.5T1G  [ONSC-SOD-523-2-502-01_V]  (value not drawn)
D22  ESD5Z2.5T1G  [ONSC-SOD-523-2-502-01_V]  (value not drawn)
D23  ESD5Z2.5T1G  [ONSC-SOD-523-2-502-01_V]  (value not drawn)
D24  ESD5Z2.5T1G  [ONSC-SOD-523-2-502-01_V]  (value not drawn)
J4  615008137421  [615008137421]
J5  618009231121  [618009231121]
P2  Header 8  [HDR1X8]
P3  Header 6  [HDR1X6]
P4  87224-3  [TECO-87224-3_V]
P5  87224-3  [TECO-87224-3_V]
P6  87224-3  [TECO-87224-3_V]
P7  87224-3  [TECO-87224-3_V]
P8  Header 6  [HDR1X6]
P9  Header 9X2A  [HDR2X9_CEN]
R188  Parameter: 100R  [RESC1005X40X25NL05T05]  (hidden comment: CRCW0402100RFKED)
R189  0R  [R0402]
R190  0R  [R0402]
R191  Parameter: 100R  [RESC1005X40X25NL05T05]  (hidden comment: CRCW0402100RFKED)
R192  Parameter: 100R  [RESC1005X40X25NL05T05]  (hidden comment: CRCW0402100RFKED)
R193  Parameter: 100R  [RESC1005X40X25NL05T05]  (hidden comment: CRCW0402100RFKED)
R194  Parameter: 100R  [RESC1005X40X25NL05T05]  (hidden comment: CRCW0402100RFKED)
R195  0R  [R0402]
R196  Parameter: 100R  [RESC1005X40X25NL05T05]  (hidden comment: CRCW0402100RFKED)
R197  Parameter: 100R  [RESC1005X40X25NL05T05]  (hidden comment: CRCW0402100RFKED)
R198  0R  [R0402]
R199  Parameter: 100R  [RESC1005X40X25NL05T05]  (hidden comment: CRCW0402100RFKED)
R200  0R  [R0402]
R201  Parameter: 100R  [RESC1005X40X25NL05T05]  (hidden comment: CRCW0402100RFKED)
R202  Parameter: 100R  [RESC1005X40X25NL05T05]  (hidden comment: CRCW0402100RFKED)
R203  Parameter: 100R  [RESC1005X40X25NL05T05]  (hidden comment: CRCW0402100RFKED)
R204  Parameter: 100R  [RESC1005X40X25NL05T05]  (hidden comment: CRCW0402100RFKED)
R205  Parameter: 100R  [RESC1005X40X25NL05T05]  (hidden comment: CRCW0402100RFKED)
R206  Parameter: 100R  [RESC1005X40X25NL05T05]  (hidden comment: CRCW0402100RFKED)
R207  Parameter: 100R  [RESC1005X40X25NL05T05]  (hidden comment: CRCW0402100RFKED)
R208  Parameter: 100R  [RESC1005X40X25NL05T05]  (hidden comment: CRCW0402100RFKED)
R209  Parameter: 100R  [RESC1005X40X25NL05T05]  (hidden comment: CRCW0402100RFKED)
R210  Parameter: 100R  [RESC1005X40X25NL05T05]  (hidden comment: CRCW0402100RFKED)
R211  value 120R  Case: 0805  [RESC2013X50X30LL20T20]  (hidden comment: CRCW0805120RJNEA)
R212  value 120R  Case: 0805  [RESC2013X50X30LL20T20]  (hidden comment: CRCW0805120RJNEA)

### Ports
ADC1_N (in), ADC1_P (in), ADC2_N (in), ADC2_P (in), CANH (bidir), CANL (bidir), COMP_EXT_IN0 (out), COMP_EXT_IN1 (out), COMP_OUT0 (in), COMP_OUT1 (in), DAC_OUT (in), ETH_JTAG_CLK (out), ETH_JTAG_TDI (out), ETH_JTAG_TDO (out), ETH_JTAG_TMS (out), EXT_TRIG_IN0 (out), EXT_TRIG_IN1 (out), EXT_TRIG_IN2 (out), EXT_TRIG_IN3 (out), G_LED_A (in), G_LED_K (out), L3_N (bidir), L3_P (bidir), L6_N (bidir), L6_P (bidir), L7_N (bidir), L7_P (bidir), L8_N (bidir), L8_P (bidir), L9_N (bidir), L9_P (bidir), L23_N (bidir), L23_P (bidir), L24_N (bidir), L24_P (bidir), RS_232_RX0 (out), RS_232_RX1 (out), RS_232_TX0 (in), RS_232_TX1 (in), TD_AO_N (bidir), TD_AO_P (bidir), TD_BO_N (bidir), TD_BO_P (bidir), TD_CO_N (bidir), TD_CO_P (bidir), TD_DO_N (bidir), TD_DO_P (bidir), Y_LED (in), Z_TCK (out), Z_TDI (out), Z_TDO (in), Z_TMS (out)

### Nets
+1V8_PER: P9.18
+3V3_PER: P3.6 P9.17
+5V0: P9.8
GND: D21.2(A) D22.2(A) D23.2(A) D24.2(A) J4.10 J4.S1 J4.S2 J5.5 J5.M1 J5.M2 P2.7 P2.8 P3.5 P4.3 P5.3 P6.3 P7.2 P7.3 P8.3 P8.4 P9.9
ADC1_P: D21.1(K) P8.1 ; port ADC1_P
ADC2_P: D23.1(K) P8.5 ; port ADC2_P
CANH: P5.1 ; port CANH
CANL: P5.2 ; port CANL
COMP_EXT_IN0: P2.5 ; port COMP_EXT_IN0
COMP_EXT_IN1: P2.6 ; port COMP_EXT_IN1
COMP_OUT0: P4.2 ; port COMP_OUT0
COMP_OUT1: P4.1 ; port COMP_OUT1
DAC_OUT: P7.1 ; port DAC_OUT
ETH_JTAG_CLK: R198.1 ; port ETH_JTAG_CLK
ETH_JTAG_TDI: R200.2 ; port ETH_JTAG_TDI
ETH_JTAG_TMS: R190.1 ; port ETH_JTAG_TMS
EXT_TRIG_IN0: P2.1 ; port EXT_TRIG_IN0
EXT_TRIG_IN1: P2.2 ; port EXT_TRIG_IN1
EXT_TRIG_IN2: P2.3 ; port EXT_TRIG_IN2
EXT_TRIG_IN3: P2.4 ; port EXT_TRIG_IN3
G_LED_A: J4.11 ; port G_LED_A
G_LED_K: J4.12 ; port G_LED_K
JTAG_CLK: R195.2 R196.1 R198.2
JTAG_TDI: R193.1 ; port ETH_JTAG_TDO
JTAG_TDO: R194.1 ; port Z_TDI
JTAG_TMS: R189.2 R190.2 R191.1
L3_N: C241.1 R210.1 ; port L3_N
L3_P: C241.2 R209.1 ; port L3_P
L3_R_N: P9.16 R210.2
L3_R_P: P9.7 R209.2
L6_N: C237.1 R202.1 ; port L6_N
L6_P: C237.2 R201.1 ; port L6_P
L6_R_N: P9.4 R202.2
L6_R_P: P9.3 R201.2
L7_N: C238.1 R204.1 ; port L7_N
L7_P: C238.2 R203.1 ; port L7_P
L7_R_N: P9.13 R204.2
L7_R_P: P9.12 R203.2
L8_N: C239.1 R206.1 ; port L8_N
L8_P: C239.2 R205.1 ; port L8_P
L8_R_N: P9.6 R206.2
L8_R_P: P9.5 R205.2
L9_N: C240.1 R208.1 ; port L9_N
L9_P: C240.2 R207.1 ; port L9_P
L9_R_N: P9.15 R208.2
L9_R_P: P9.14 R207.2
L23_N: C235.1 R192.1 ; port L23_N
L23_P: C235.2 R188.1 ; port L23_P
L23_R_N: P9.2 R192.2
L23_R_P: P9.1 R188.2
L24_N: C236.1 R199.1 ; port L24_N
L24_P: C236.2 R197.1 ; port L24_P
L24_R_N: P9.11 R199.2
L24_R_P: P9.10 R197.2
RS_232_RX0: R212.1 ; port RS_232_RX0
RS_232_RX1: P6.2 ; port RS_232_RX1
RS_232_TX0: R211.1 ; port RS_232_TX0
RS_232_TX1: P6.1 ; port RS_232_TX1
SENSE_1_N: D22.1(K) P8.2 ; port ADC1_N
SENSE_2_N: D24.1(K) P8.6 ; port ADC2_N
TD_AO_N: J4.2 ; port TD_AO_N
TD_AO_P: J4.1 ; port TD_AO_P
TD_BO_N: J4.4 ; port TD_BO_N
TD_BO_P: J4.3 ; port TD_BO_P
TD_CO_N: J4.6 ; port TD_CO_N
TD_CO_P: J4.5 ; port TD_CO_P
TD_DO_N: J4.8 ; port TD_DO_N
TD_DO_P: J4.7 ; port TD_DO_P
Y_LED: J4.9 ; port Y_LED
Z_TCK: R195.1 ; port Z_TCK
Z_TDO: R200.1 ; port Z_TDO
Z_TMS: R189.1 ; port Z_TMS
NetJ5_2: J5.2 R211.2
NetJ5_3: J5.3 R212.2
NetP3_1: P3.1 R191.2
NetP3_2: P3.2 R193.2
NetP3_3: P3.3 R194.2
NetP3_4: P3.4 R196.2

Not connected (* = marked no-connect by the designer): J5 1 4 6 7 8 9

### Layout directives
differential pair: L3_R_N, L3_R_P, L6_R_N, L6_R_P, L7_R_N, L7_R_P, L8_R_N, L8_R_P, L9_R_N, L9_R_P, L23_R_N, L23_R_P, L24_R_N, L24_R_P, TD_AO_N, TD_AO_P, TD_BO_N, TD_BO_P, TD_CO_N, TD_CO_P, TD_DO_N, TD_DO_P

### Notes on the sheet
- CONNECTORS
- 12V Comp Out
- External Trig In
- Differential Pairs
- JTAG (Z7010 −> ETH)
- 10
- 15
- 11
- 9
- 8
- (near P5) CAN
- (near P6) RS-232 -1
- Ethernet Conn
- 12
- 14
- (near P7) DAC OUT
- (near P8) ADC1/ ADC2
- RS-232 -0 DB9 Conn
- Diff Pair Conn
- Labels drawn without touching a wire or pin: NOTE: BANK 35 IS 3V3, BANK34 IS 1V8
- Title
- Size:
- Date:
- B
- Number:
- Time:
- Revision:
- Sheet
- of
- Mathew Locoteta
- 85 Artist Lake Dr.
- Middle Island
- New York, 11953
- United States of America
- File:

### Library data of the parts
C235-C241 = CMP-2008-04254-1: Manufacturer: Murata; Part Number: GRM1555C1H102JA01D
D21-D24 = CMP-1063-00103-1: as D13 on sheet [13] - HMI; ComponentLink3Description: Package Specification; Packing: Tape and Reel; ComponentLink2URL: http://www.onsemi.cn/pub_link/Collateral/ESD5Z2.5T1-D.PDF; ComponentLink3URL: http://www.onsemi.com/pub_link/Collateral/502-01.PDF; PackageReference: SOD-523-2-502-01; PartNumber: ESD5Z2.5T1G; Mounting Technology: Surface Mount; DatasheetVersion: Rev. 10; PackageVersion: Rev. E, 09/2010; RoHS: Pb-Free; ComponentLink1Description: Manufacturer URL; PackageDescription: 2-Pin SOD, Body 1.2 x 0.8 mm; ComponentLink2Description: Datasheet; ComponentLink1URL: http://www.onsemi.com/
J4 = CMP-1502-01697-1: Modular Jack WR-MJ, Tab Up, Shielded, with LED and EMI Panel Finger, Horizontal Entry, THT, 8P8C; Manufacturer: Wurth Elektronik; Compliance: Leadfree/RoHS; Withstanding Voltage: 1000VAC; Port: 1x1; Contact Resistance: 20mOhm; Rated Current: 1.5A; Working Voltage: 120VAC; Manufacturer URL: http://www.we-online.de; Mounting Technology: THT; Entrance: Horizontal; Datasheet URL: https://katalog.we-online.de/em/datasheet/615008137421.pdf; Packaging: Tray; Package Reference: 615008137421; Publisher: WurthElektronik; Operating Temperature: -40to85degC; Part Number: 615008137421; Pin Number: 8P8C
J5 = CMP-1502-00200-1: Female PCB Connector with Hex Screw WR-DSUB, 8.08 mm, Angled, 9 pins; Manufacturer: Wurth Elektronik; Contact Resistance: 30mOhm; Pin Number: 9; Working Voltage: 125VAC; Rated Current: 3A; Gender: Female; Datasheet URL: https://katalog.we-online.de/em/datasheet/6180xx231121.pdf; Packaging: Tray; Package Reference: 618009231121; Operating Temperature: -40to85degC; Manufacturer URL: http://www.we-online.de; Publisher: WurthElektronik; Mounting Technology: THT; Part Number: 618009231121; Orientation: Angled
P2 = Header 8: Header, 8-Pin; LatestRevisionDate: 17-Jul-2002; LatestRevisionNote: Re-released for DXP Platform.; Publisher: Altium Limited
P3 P8 = Header 6: Header, 6-Pin; LatestRevisionDate: 17-Jul-2002; LatestRevisionNote: Re-released for DXP Platform.; Publisher: Altium Limited
P4-P7 = CMP-2000-05697-1: Male Header, Pitch 2.54 mm, 1 x 3 Position, Height 10.744 mm, Tail Length 3.175 mm, -65 to 105 degC, RoHS, Bulk; Manufacturer: TE Connectivity; Catalog Drawings: SingleSquareStraightPost / SingleSquareStraightPostSide; Connector Type: Header,Unshrouded; Pitch: 0.100"(2.54mm); Mating Products: 147738-2-ND / -CONNRCPT3POSVERTSMDGOLD / 147723-2-ND / -CONNRCPT3POSVERT.100GOLD / 146763-5-ND / -CONNRCPT3POSSGLVERT.100T/H / A32904-ND / -CONNRECEPT3POS.100VERTGOLD / A26922-ND / -CONNHOUSING3POS.100LOCKING / A26415-ND / -CONNRECEPT3POS.100VERTAU / A26964-ND / -CONNHOUSING3POS.100SINGLE / A3012-ND / -CONNHOUSING3POS.100SINGLE; Number of Positions Loaded: All; Featured Product: AMPMODUConnectors; Dynamic Catalog: AMPMODUModIISeries; 3D Model: 87224-3.pdf; Other Names: 87224-3-ND / A26545; Number of Positions: 3; RoHS Information: 87224-3StatementofCompliance; Termination: Solder; Datasheet URL: http://www.te.com/commerce/DocumentDelivery/DDEController?Action=showdoc&DocId=Customer+Drawing%7F87224%7FL3%7Fpdf%7FEnglish%7FENG_CD_87224_L3.pdf%7F87224-3; Category: Connectors,Interconnects; Contact Mating Length: 0.318"(8.08mm); Standard Package: 520; Mounting Type: ThroughHole; Family: RectangularConnectors-Headers,MalePins; Number of Rows: 1; Series: AMPMODUModII; Contact Finish Thickness: 15µin(0.38µm); Datasheet Version: Rev. L3, 08/2015; Package Reference: 87224-3; Mounting Technology: ThroughHole; Manufacturer URL: http://www.te.com/; Contact Type: MalePin; Packaging: Bulk; Color: Black; Package Description: Male Header, Pitch 2.54 mm, 1 x 3 Position, Height 10.744 mm, Tail Length 3.175 mm; Contact Finish: Gold
P9 = Header 9X2A: Header, 9-Pin, Dual row; LatestRevisionDate: 17-Jul-2002; LatestRevisionNote: Re-released for DXP Platform.; Publisher: Altium Limited
R188 R191-R194 R196 R197 R199 R201-R210 = CMP-2002-08127-1: Manufacturer: Vishay Dale; Part Number: CRCW0402100RFKED
R189 R190 R195 R198 R200 = RMCF0402ZT0R00: RES 0 OHM JUMPER 1/16W 0402; Manufacturer: Stackpole Electronics; Max Power Dissipation: 63mW; Current Rating: 1A; Working Voltage: 50V; Resistance: 0mR; Supplier 1: Digi-Key; Manufacturer Part Number: RMCF0402ZT0R00; RoHS: Yes; Category: Chip SMD Resistors; Stock 1: 3707577; Pricing 1: 1=0.10000, 10=0.01100, 25=0.00800, 50=0.00620, 100=0.00450, 250=0.00348, 500=0.00278, 1000=0.00204, 5000=0.00146 (USD); Mount: Surface Mount; Case/Package: 0402; Contact Plating: Tin,Matte; Case Code (Metric): 1005; Case Code (Imperial): 0402; Min Operating Temperature: -55°C; Max Operating Temperature: 155°C; Composition: Thick Film; Number of Terminations: 2; Military Standard: Not; Power Rating: 63mW; Packaging: Tape and Reel; Features: Automotive AEC-Q200; Length: 0.039inch; Height: 0.016inch; Depth: 0.5mm; Width: 0.02inch; Radiation Hardening: No; Lead Free: Lead Free; ComponentLink1URL: https://datasheet.ciiva.com/26835/getdatasheetpartid-409751-26835612.pdf?src-supplier=Verical; ComponentLink1Description: https://datasheet.ciiva.com/26835/getdatasheetpartid-409751-26835612.pdf?src-supplier=Verical; Supplier Part Number 1: RMCF0402ZT0R00DKR-ND
R211 R212 = CMP-2001-04288-1: Manufacturer: Vishay Dale; Part Number: CRCW0805120RJNEA